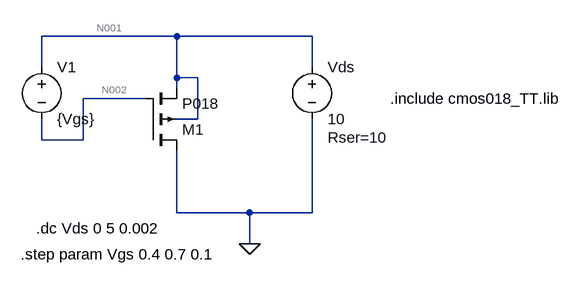
[diagram p0: schematic P018_Char.asc]
P018_Char.asc, the LTspice schematic file:
Version 4
SHEET 1 880 680
WIRE 208 80 0 80
WIRE 416 80 208 80
WIRE 0 128 0 80
WIRE 416 128 416 80
WIRE 208 144 208 80
WIRE 240 144 208 144
WIRE 208 160 208 144
WIRE 160 176 64 176
WIRE 240 208 240 144
WIRE 240 208 208 208
WIRE 0 240 0 208
WIRE 64 240 64 176
WIRE 64 240 0 240
WIRE 208 352 208 256
WIRE 320 352 208 352
WIRE 416 352 416 208
WIRE 416 352 320 352
WIRE 320 400 320 352
FLAG 320 400 0
SYMBOL voltage 0 112 R0
WINDOW 123 0 0 Left 0
WINDOW 39 0 0 Left 0
SYMATTR InstName V1
SYMATTR Value {Vgs}
SYMBOL voltage 416 112 R0
WINDOW 123 0 0 Left 0
WINDOW 39 24 124 Left 2
SYMATTR SpiceLine Rser=10
SYMATTR InstName Vds
SYMATTR Value 10
SYMBOL pmos4 160 256 M180
SYMATTR InstName M1
SYMATTR Value P018
SYMATTR Value2 l=0.5u w=10u
TEXT 536 176 Left 2 !.include cmos018_TT.lib
TEXT -8 376 Left 2 !.dc Vds 0 5 0.002
TEXT -32 416 Left 2 !.step param Vgs 0.4 0.7 0.1

The netlist it stands for:
* P018_Char.asc
V1 N001 N002 {Vgs}
Vds N001 0 10 Rser=10
M1 0 N002 N001 N001 P018 l=0.5u w=10u
.model NMOS NMOS
.model PMOS PMOS
.lib standard.mos
.include cmos018_TT.lib
.dc Vds 0 5 0.002
.step param Vgs 0.4 0.7 0.1
.backanno
.end

* Results of the author's LTspice run, read from the files saved beside the schematic
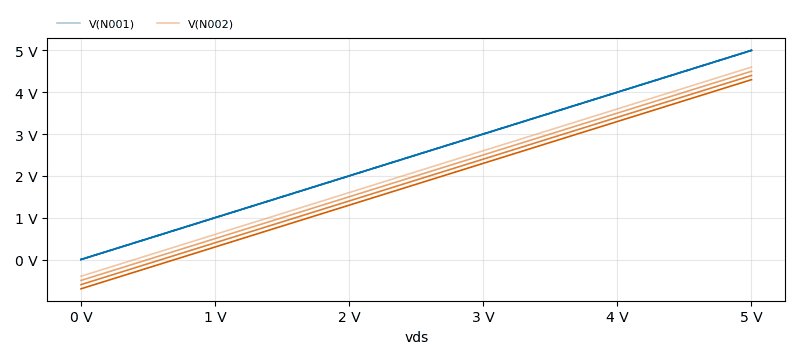
[diagram p1: DC transfer characteristic of P018_Char.asc, plotted from the saved traces]
* DC transfer characteristic, 4 runs:
*   V(N001) [vgs=0.4]: 1.253e-06 fV at vds=0 V, 5 V at vds=5 V, min 1.253e-06 fV, max 5 V
*   V(N001) [vgs=0.5]: -2.807e-06 fV at vds=0 V, 5 V at vds=5 V, min -2.807e-06 fV, max 5 V
*   V(N001) [vgs=0.6]: 8.335e-06 fV at vds=0 V, 5 V at vds=5 V, min 8.335e-06 fV, max 5 V
*   V(N001) [vgs=0.7]: 7.216e-05 fV at vds=0 V, 4.999 V at vds=5 V, min 7.216e-05 fV, max 4.999 V
*   V(N002) [vgs=0.4]: -400 mV at vds=0 V, 4.6 V at vds=5 V, min -400 mV, max 4.6 V
*   V(N002) [vgs=0.5]: -500 mV at vds=0 V, 4.5 V at vds=5 V, min -500 mV, max 4.5 V
*   V(N002) [vgs=0.6]: -600 mV at vds=0 V, 4.4 V at vds=5 V, min -600 mV, max 4.4 V
*   V(N002) [vgs=0.7]: -700 mV at vds=0 V, 4.299 V at vds=5 V, min -700 mV, max 4.299 V